# EAGLE design Hovilink (EAGLE 7.7.0)
CREVISION: 2.0; DESIGNER: Jef Patat
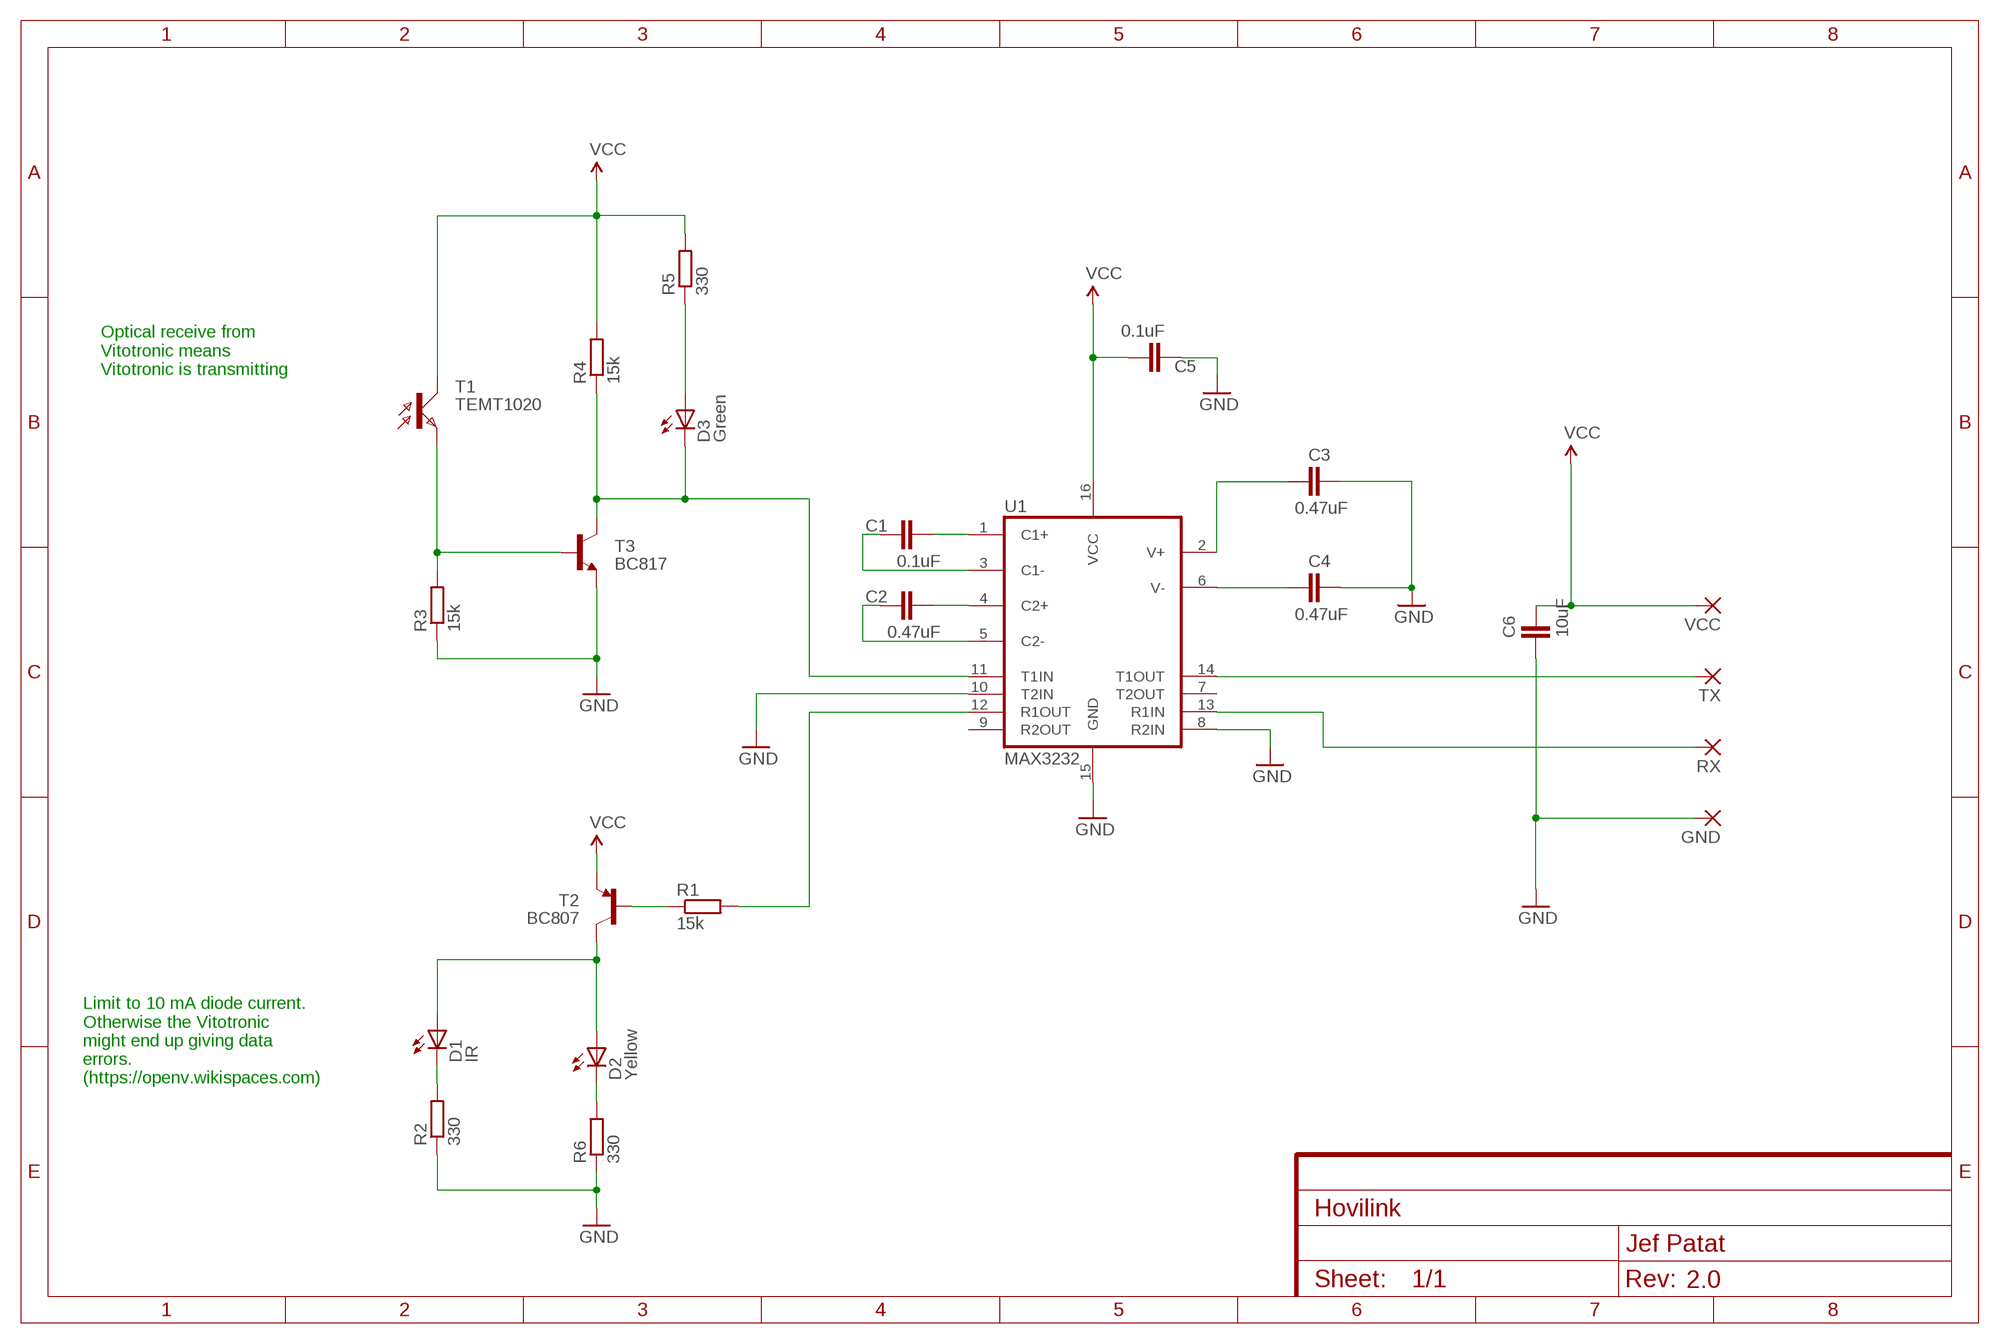
[diagram p0: schematic, sheet 1]

## Parts
C1  0.1uF  C1206  [1206]
C2  0.47uF  C1206  [1206]
C3  0.47uF  C1206  [1206]
C4  0.47uF  C1206  [1206]
C5  0.1uF  C1206  [1206]
C6  10uF  C1206  [1206]
D1  TSMF1020  [TSMF1020]
D2  KP-2012SYCK  [KNIGHTBRIGHT_2.0X1.25_SMD_LED]
D3  KP-2012CGCK  [KNIGHTBRIGHT_2.0X1.25_SMD_LED]
GND  WIREPAD_2,54/1,3  [WIREPAD_2,54/1,3]
R1  15k  R1206  [1206]
R2  330  R1206  [1206]
R3  15k  R1206  [1206]
R4  15k  R1206  [1206]
R5  330  R1206  [1206]
R6  330  R1206  [1206]
RX  WIREPAD_2,54/1,3  [WIREPAD_2,54/1,3]
T1  TEMT1020  [TEMT1020]
T2  BC807  [SOT23_3]
T3  BC817  [SOT23_3]
TX  WIREPAD_2,54/1,3  [WIREPAD_2,54/1,3]
U1  MAX3232  [SOIC16]
VCC  WIREPAD_2,54/1,3  [WIREPAD_2,54/1,3]

## Nets
GND: C3.2 C4.2 C5.1 C6.1 GND.1(P) R2.1 R3.1 R6.1 T3.2(E) U1.8(R2IN) U1.10(T2IN) U1.15(GND)
N$1: C4.1 U1.6(V-)
N$2: C3.1 U1.2(V+)
N$3: R1.1 T2.1(B)
N$4: C1.2 U1.1(C1+)
N$5: C1.1 U1.3(C1-)
N$6: C2.2 U1.4(C2+)
N$7: C2.1 U1.5(C2-)
N$8: D1.P$1(C) R2.2
N$9: D1.P$2(A) D2.P$1(A) T2.3(C)
N$10: R1.2 U1.12(R1OUT)
N$11: TX.1(P) U1.14(T1OUT)
N$12: RX.1(P) U1.13(R1IN)
N$13: R3.2 T1.P$2(E) T3.1(B)
N$15: D3.P$2(C) R4.1 T3.3(C) U1.11(T1IN)
N$16: D2.P$2(C) R6.2
N$17: D3.P$1(A) R5.1
VCC: C5.2 C6.2 R4.2 R5.2 T1.P$1(C) T2.2(E) U1.16(VCC) VCC.1(P)
Unconnected: U1.7(T2OUT) U1.9(R2OUT)

## Notes on the sheet
- Optical receive from 
  Vitotronic means 
  Vitotronic is transmitting
- Limit to 10 mA diode current.
  Otherwise the Vitotronic
  might end up giving data
  errors.
  (https://openv.wikispaces.com)

## Library data of the parts
C1-C6 = Bruno:C1206
D1 = Bruno:TSMF1020: High Speed Infrared Emitting Diode 890 nm; FARNELL: 1469628
D2 = Bruno:KP-2012SYCK: Yellow Low Power LED 20 mA, 2 V; FARNELL: 1318246
D3 = Bruno:KP-2012CGCK: Green Low Power LED 20 mA, 2.1 V; FARNELL: 2290331
GND RX TX VCC = Bruno:WIREPAD_2,54/1,3: THROUGH-HOLE PAD
R1-R6 = Bruno:R1206
T1 = Bruno:TEMT1020; FARNELL: 1470165
T2 = Bruno:BC807; FARNELL: 1081222
T3 = Bruno:BC817; FARNELL: 2319249
U1 = Bruno:MAX3232; FARNELL: 1287437

## Board
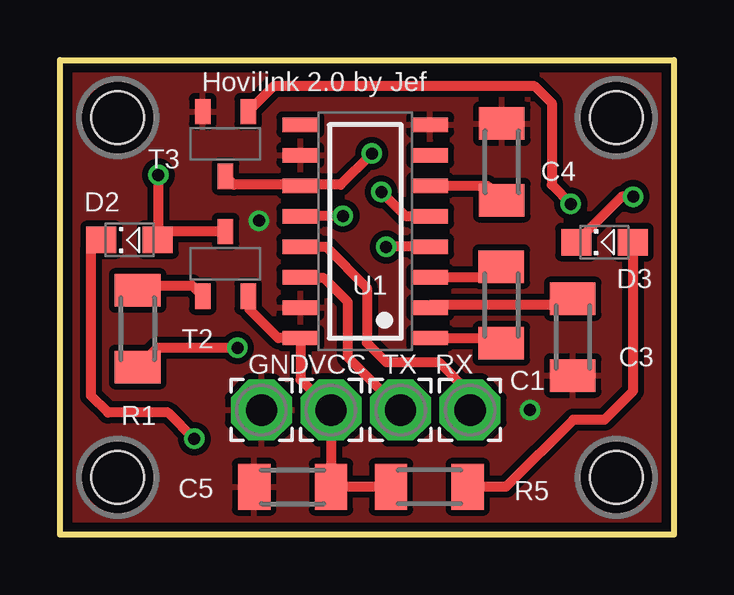
[diagram p1: board, top side]
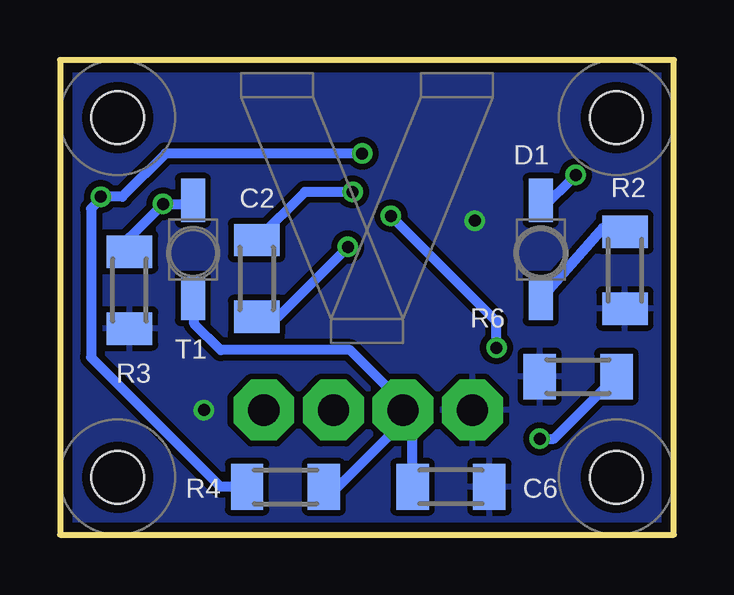
[diagram p2: board, bottom side, seen from below]

Size 25.6 x 19.8 mm. Coordinates in mm from the lower left corner, seen from the top.
Outline: 0,0 0,19.8 25.6,19.8 25.6,0 0,0
Copper layers (1*16): Top 0.0356mm / dielectric 1.5011mm / Bottom 0.0356mm
Design rules "Bruno *": minimum track width 10mil, minimum drill 13mil, track to track 10mil, track to pad 10mil, pad to pad 10mil, via to via 10mil, smd to smd 10mil, copper to edge 15mil, drill to drill 10mil, minimum pad ring 7mil, minimum via ring 7mil, stop-mask expansion 2.5mil, vias tented up to drill 20mil, thermal gap 10mil
Holes 2.2 mm at 2.4,17.4 23.2,17.4 2.4,2.4 23.2,2.4

### Footprints (pad centres in the part's own frame; a part is rotated, then mirrored left to right if it is on the bottom)
1206 = smd 1.35 x 1.9: 1 -1.6,0; 2 1.6,0
TSMF1020 = smd 1.8 x 1: P$1 -2.05,0; P$2 2.05,0
KNIGHTBRIGHT_2.0X1.25_SMD_LED = smd 1.25 x 1.1: P$1 -1.175,0; P$2 1.175,0
WIREPAD_2,54/1,3 = drill 1.3 pad 2.54 octagon: 1 0,0
TEMT1020 = smd 1.8 x 1: P$1 -2.05,0; P$2 2.05,0
SOT23_3 = smd 0.65 x 1.05: 1 -0.95,-1.35; 2 0.95,-1.35; 3 0,1.35
SOIC16 = smd 0.6 x 1.5: 1 -4.445,-2.7; 2 -3.175,-2.7; 3 -1.905,-2.7; 4 -0.635,-2.7; 5 0.635,-2.7; 6 1.905,-2.7; 7 3.175,-2.7; 8 4.445,-2.7; 9 4.445,2.7; 10 3.175,2.7; 11 1.905,2.7; 12 0.635,2.7; 13 -0.635,2.7; 14 -1.905,2.7; 15 -3.175,2.7; 16 -4.445,2.7

### Placement (x,y rotation side)
C1  18.4,9.58 270 top
C2  17.4,10.69 270 bottom
C3  21.38,8.24 270 top
C4  18.42,15.55 90 top
C5  9.7,2 0 top
C6  9.3,2 180 bottom
D1  5.55,11.9 90 bottom
D2  2.9,12.3 180 top
D3  22.7,12.2 180 top
GND  8.4,5.2 270 top
R1  3.24,8.59 270 top
R2  2.04,11.03 90 bottom
R3  22.7,10.2 90 bottom
R4  16.2,2 0 bottom
R5  15.4,2 180 top
R6  4,6.6 0 bottom
RX  17.1,5.2 270 top
T1  20.05,11.9 90 bottom
T2  6.9,11.3 0 top
T3  6.9,16.3 180 top
TX  14.2,5.2 270 top
U1  12.73,12.65 90 top
VCC  11.3,5.2 270 top

### Tracks (layer width: path | path; a pad name or v marks a point on that pad's centre or on a via)
GND  (via drill 0.5)
  other vias: 19.6,5.2 8.3,13.1
  pour Top (isolate 0.254): 0,0 0,19.8 25.6,19.8 25.6,0
  pour Bottom (isolate 0.254): 0,0 0,19.8 25.6,19.8 25.6,0
N$1
  Top 0.406: U1.6 17.82,14.55 C4.1
N$2
  Top 0.406: C3.1 21.11,9.57 15.43,9.57 U1.2
N$3
  Top 0.406: 3.21,10.49 R1.1 3.33,10.4 5.5,10.4 T2.1
N$4
  Top 0.406: U1.1 18.27,8.21 C1.2
N$5
  Top 0.406: U1.3 17.86,10.74 C1.1
N$6  (via drill 0.5)
  Top 0.406: U1.4 13.62,12.02 v13.6,12
  Bottom 0.406: C2.2 16.51,9.09 v13.6,12
N$7  (via drill 0.5)
  Top 0.406: v13.4,14.3 14.4,13.3 15.41,13.3 U1.5
  Bottom 0.406: v13.4,14.3 15.39,14.3 C2.1
N$8
  Bottom 0.406: R2.2 2.92,12.83 D1.P$1
N$9  (via drill 0.5)
  Top 0.406: v4.1,15 4.1,13.03 D2.P$1 4.42,12.65 T2.3
  Bottom 0.406: D1.P$2 5.5,13.6 v4.1,15
N$10  (via drill 0.5)
  Top 0.406: v11.8,13.3 U1.12 | v7.4,7.8 4.05,7.8 R1.2
  Bottom 0.406: v7.4,7.8 7.4,8.9 v11.8,13.3
N$11
  Top 0.406: TX.1 12,7.4 12,9.7 11,10.7 10.07,10.7 U1.14
N$12
  Top 0.406: U1.13 11.09,12.02 12.8,10.3 12.8,8 13.6,7.2 15.8,7.2 17.1,5.9 RX.1
N$13  (via drill 0.5)
  Top 0.406: 7.85,17.85 T3.1 8.9,18.7 19.8,18.7 20.5,18 20.5,14.6 v21.3,13.8
  Bottom 0.406: T1.P$2 20.15,13.7 20.15,13.55 | 20,13.65 T1.P$2 | 20.1,14 T1.P$2 | T1.P$2 20.2,13.8 v21.3,13.8 22.7,12.4 R3.2
N$15  (via drill 0.5)
  Top 0.406: 7,15 6.95,14.95 T3.3 7.25,14.6 9.98,14.6 U1.11 10.07,14.6 11.7,14.6 v13,15.9 | v23.9,14.1 23.43,14.1 D3.P$2
  Bottom 0.406: v13,15.9 21.2,15.9 23,14.1 v23.9,14.1 23.9,14 24.3,13.6 24.3,7.4 18.9,2 R4.1
N$16  (via drill 0.5)
  Top 0.406: v5.6,4 4.5,5.1 2,5.1 1.3,5.8 1.3,11.88 D2.P$2
  Bottom 0.406: v5.6,4 5,4 R6.2
N$17
  Top 0.406: R5.1 18.6,2 21.4,4.8 22.7,4.8 23.9,6 23.9,12.38 D3.P$1
VCC
  Top 0.406: 11.2,2.6 C5.2 | R5.2 C5.2 | C5.2 VCC.1 10.03,6.47 U1.16 9.1,8.21 7.9,9.4 7.9,9.9 T2.2
  Bottom 0.406: 14.9,1.9 R4.2 14,2 11.3,4.7 VCC.1 | T1.P$1 20,10.15 20,8.8 18.9,7.7 13.5,7.7 11.3,5.5 VCC.1 | C6.2 10.9,4.8 VCC.1

### Text on the board
tNames: Hovilink 2.0 by Jef